# Altium schematic sheet Структура.SchDoc
size A3; DocumentNumber: 1; SheetNumber: 1; SheetTotal: 12
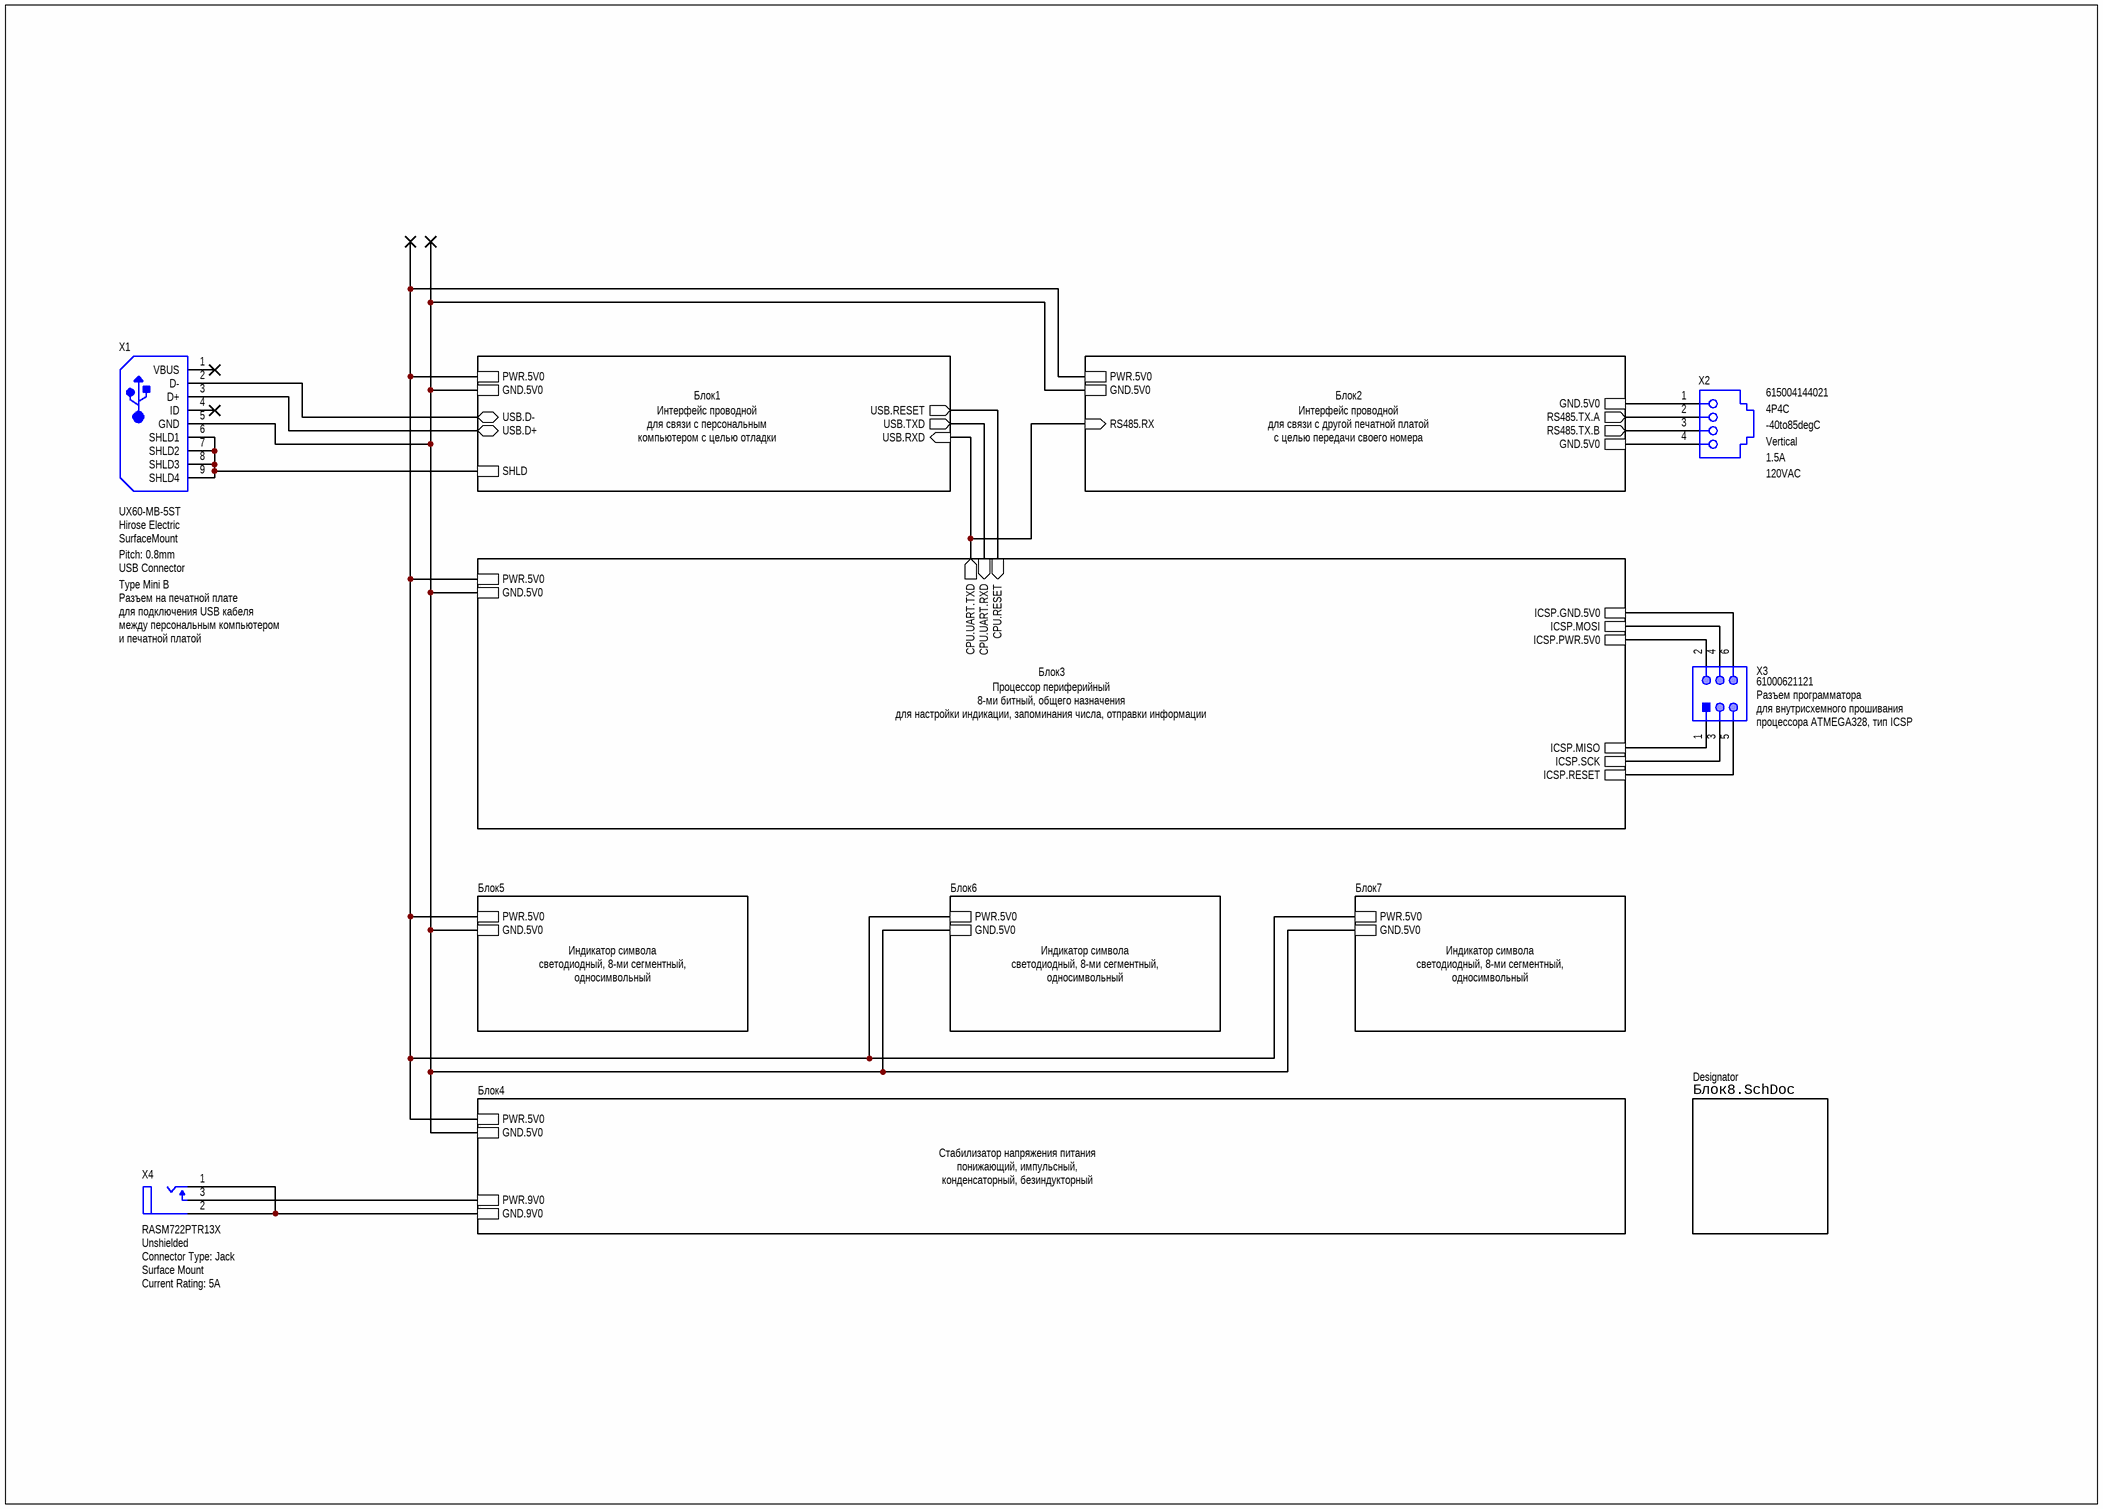
[diagram p0: Структура.SchDoc]

## Parts
X1  UX60-MB-5ST  Manufacturer: Hirose Electric  Termination: SurfaceMount  Pitch: 0.8mm  Parameter 1: USB Connector  Parameter 2: Type Mini B  Parameter 3: Разъем на печатной плате  Parameter 4: для подключения USB кабеля  Parameter 5: между персональным компьютером  Parameter 6: и печатной платой  [HIRO-UX60-MB-5ST_V]
X2  615004144021  Pin Number: 4P4C  Operating Temperature: -40to85degC  Entrance: Vertical  Rated Current: 1.5A  Working Voltage: 120VAC  [615004144021]
X3  61000621121  Parameter 1: Разъем программатора  Parameter 2: для внутрисхемного прошивания  Parameter 3: процессора ATMEGA328, тип ICSP  [61000621121]
X4  RASM722PTR13X  Shielding: Unshielded  Connector Type: Jack  Mount: Surface Mount  Current Rating: 5A  [FP-RASM722PTR13X-MFG]

## Sub-sheets
Designator = Блок8.SchDoc: no entries
Блок1 = Блок1.SchDoc: USB.RXD (in), USB.TXD (out), USB.RESET (out), GND.5V0, PWR.5V0, USB.D- (bidir), USB.D+ (bidir), SHLD  | Parameter 1: Интерфейс проводной; Parameter 2: для связи с персональным; Parameter 3: компьютером с целью отладки
Блок2 = Блок2.SchDoc: PWR.5V0, GND.5V0, RS485.TX.A (out), GND.5V0, RS485.TX.B (out), GND.5V0, RS485.RX (in)  | Parameter 1: Интерфейс проводной; Parameter 2: для связи с другой печатной платой; Parameter 3: с целью передачи своего номера
Блок3 = Блок3.SchDoc: CPU.UART.TXD (out), CPU.UART.RXD (in), CPU.RESET (in), PWR.5V0, GND.5V0, ICSP.MISO, ICSP.SCK, ICSP.RESET, ICSP.PWR.5V0, ICSP.MOSI, ICSP.GND.5V0  | Parameter 1: Процессор периферийный; Parameter 2: 8-ми битный, общего назначения; Parameter 3: для настройки индикации, запоминания числа, отправки информации
Блок4 = Блок4.SchDoc: GND.9V0, PWR.5V0, PWR.9V0, GND.5V0  | Parameter 1: Стабилизатор напряжения питания; Parameter 2: понижающий, импульсный,; Parameter 3: конденсаторный, безиндукторный
Блок5 = Блок5.SchDoc: GND.5V0, PWR.5V0  | Parameter 1: Индикатор символа; Parameter 2: светодиодный, 8-ми сегментный,; Parameter 3: односимвольный
Блок6 = Блок6.SchDoc: GND.5V0, PWR.5V0  | Parameter 1: Индикатор символа; Parameter 2: светодиодный, 8-ми сегментный,; Parameter 3: односимвольный
Блок7 = Блок7.SchDoc: PWR.5V0, GND.5V0  | Parameter 1: Индикатор символа; Parameter 2: светодиодный, 8-ми сегментный,; Parameter 3: односимвольный

## Nets
NetX1_2: X1.2(D-) ; sheet Блок1/USB.D-
NetX1_3: X1.3(D+) ; sheet Блок1/USB.D+
NetX1_5: X1.5(GND) ; sheet Блок3/GND.5V0, sheet Блок5/GND.5V0, sheet Блок4/GND.5V0, sheet Блок7/GND.5V0, sheet Блок6/GND.5V0, sheet Блок1/GND.5V0, sheet Блок2/GND.5V0
NetX1_6: X1.6(SHLD1) X1.7(SHLD2) X1.8(SHLD3) X1.9(SHLD4) ; sheet Блок1/SHLD
NetX2_1: X2.1 ; sheet Блок2/GND.5V0
NetX2_2: X2.2 ; sheet Блок2/RS485.TX.A
NetX2_3: X2.3 ; sheet Блок2/RS485.TX.B
NetX2_4: X2.4 ; sheet Блок2/GND.5V0
NetX3_1: X3.1 ; sheet Блок3/ICSP.MISO
NetX3_2: X3.2 ; sheet Блок3/ICSP.PWR.5V0
NetX3_3: X3.3 ; sheet Блок3/ICSP.SCK
NetX3_4: X3.4 ; sheet Блок3/ICSP.MOSI
NetX3_5: X3.5 ; sheet Блок3/ICSP.RESET
NetX3_6: X3.6 ; sheet Блок3/ICSP.GND.5V0
NetX4_1: X4.1(TIP_TERMINAL(CENTER_PIN)) X4.2(SLEEVE_TERMINAL) ; sheet Блок4/GND.9V0
NetX4_3: X4.3(SHUNT_TERMINAL) ; sheet Блок4/PWR.9V0
(unnamed): sheet Блок3/CPU.UART.TXD, sheet Блок1/USB.RXD, sheet Блок2/RS485.RX
(unnamed): sheet Блок3/CPU.UART.RXD, sheet Блок1/USB.TXD
(unnamed): sheet Блок3/CPU.RESET, sheet Блок1/USB.RESET
(unnamed): sheet Блок3/PWR.5V0, sheet Блок5/PWR.5V0, sheet Блок4/PWR.5V0, sheet Блок7/PWR.5V0, sheet Блок6/PWR.5V0, sheet Блок1/PWR.5V0, sheet Блок2/PWR.5V0

Not connected (* = marked no-connect by the designer): X1 1(VBUS)* 4(ID)*

## Library data of the parts
X1 = CMP-2000-07375-1: USB Connector Mini B Type, 1 A, 5 V AC, -30 to 75 degC, 5-Pin SMD, RoHS, Tape and Reel; No of Positions: 5; Style/Orientation: RightAngleSocket/Receptacle; Datasheet Version: 04/2008; Datasheet URL: http://datasheet.octopart.com/UX60-MB-5ST-Hirose-datasheet-8329595.pdf; Type: WiretoBoard; Package Reference: UX60-MB-5ST; Manufacturer URL: https://www.hirose.com; Mounting Technology: SurfaceMount; Package Description: 5-Pin Surface Mount Device, Body 7.7 x 9 mm, Pitch 0.8 mm
X2 = CMP-1502-01721-1: Modular Jack WR-MJ, Plastic, with Panel Stop, Vertical Entry, THT, 4P4C; Manufacturer: Wurth Elektronik; Compliance: Leadfree/RoHS; Withstanding Voltage: 1000VAC; Contact Resistance: 20mOhm; Port: 1x1; Цена: 10 руб; Part Number: 615004144021; Manufacturer URL: http://www.we-online.de; Package Reference: 615004144021; Mounting Technology: THT; Publisher: WurthElektronik; Datasheet URL: https://katalog.we-online.de/em/datasheet/615004144021.pdf; Packaging: Tray
X3 = CMP-1502-01024-1: SMT Vertical Pin Header WR-PHD, Pitch 2.54 mm, Dual Row, 6 pins; Manufacturer: Wurth Elektronik; Withstanding Voltage: 500VAC; Contact Resistance: 20mOhm; Working Voltage: 250VAC; Gender: Male; Rated Current: 3A; Pin Number: 6; Pitch: 2.54mm; Part Number: 61000621121; Operating Temperature: -40to125degC; Mounting Technology: SMT; Packaging: Tube; Datasheet URL: https://katalog.we-online.de/em/datasheet/6100xx21121.pdf; Package Reference: 61000621121; Publisher: WurthElektronik; Row Number: Dual; Orientation: Vertical; Manufacturer URL: http://www.we-online.de
X4 = CMP-47995-000002-1: CONN PWR JACK 2.1X5.5MM SOLDER; Gender: Male; Termination: Solder; Contact Material: Copper Alloy; Package Quantity: 120; Case/Package: SMD/SMT; Contact Plating: Tin; Housing Material: Thermoplastic; Housing Color: Black; Color: Black